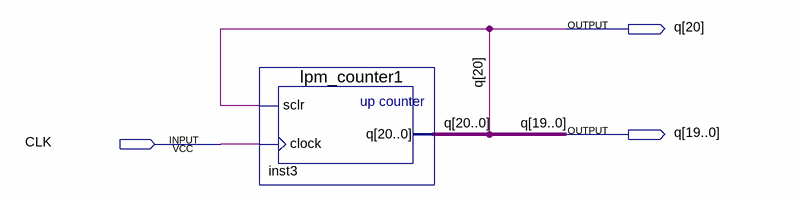
[diagram p0: schematic sheet]
// Quartus schematic 20-Bit-Counter.bdf as structural Verilog: 1 symbols, 3 pins
module \20-Bit-Counter  (
  input  CLK,
  output [20:0] q
);

  lpm_counter1 inst3 (.sclr(q[20]), .clock(CLK), .q(q));
endmodule
